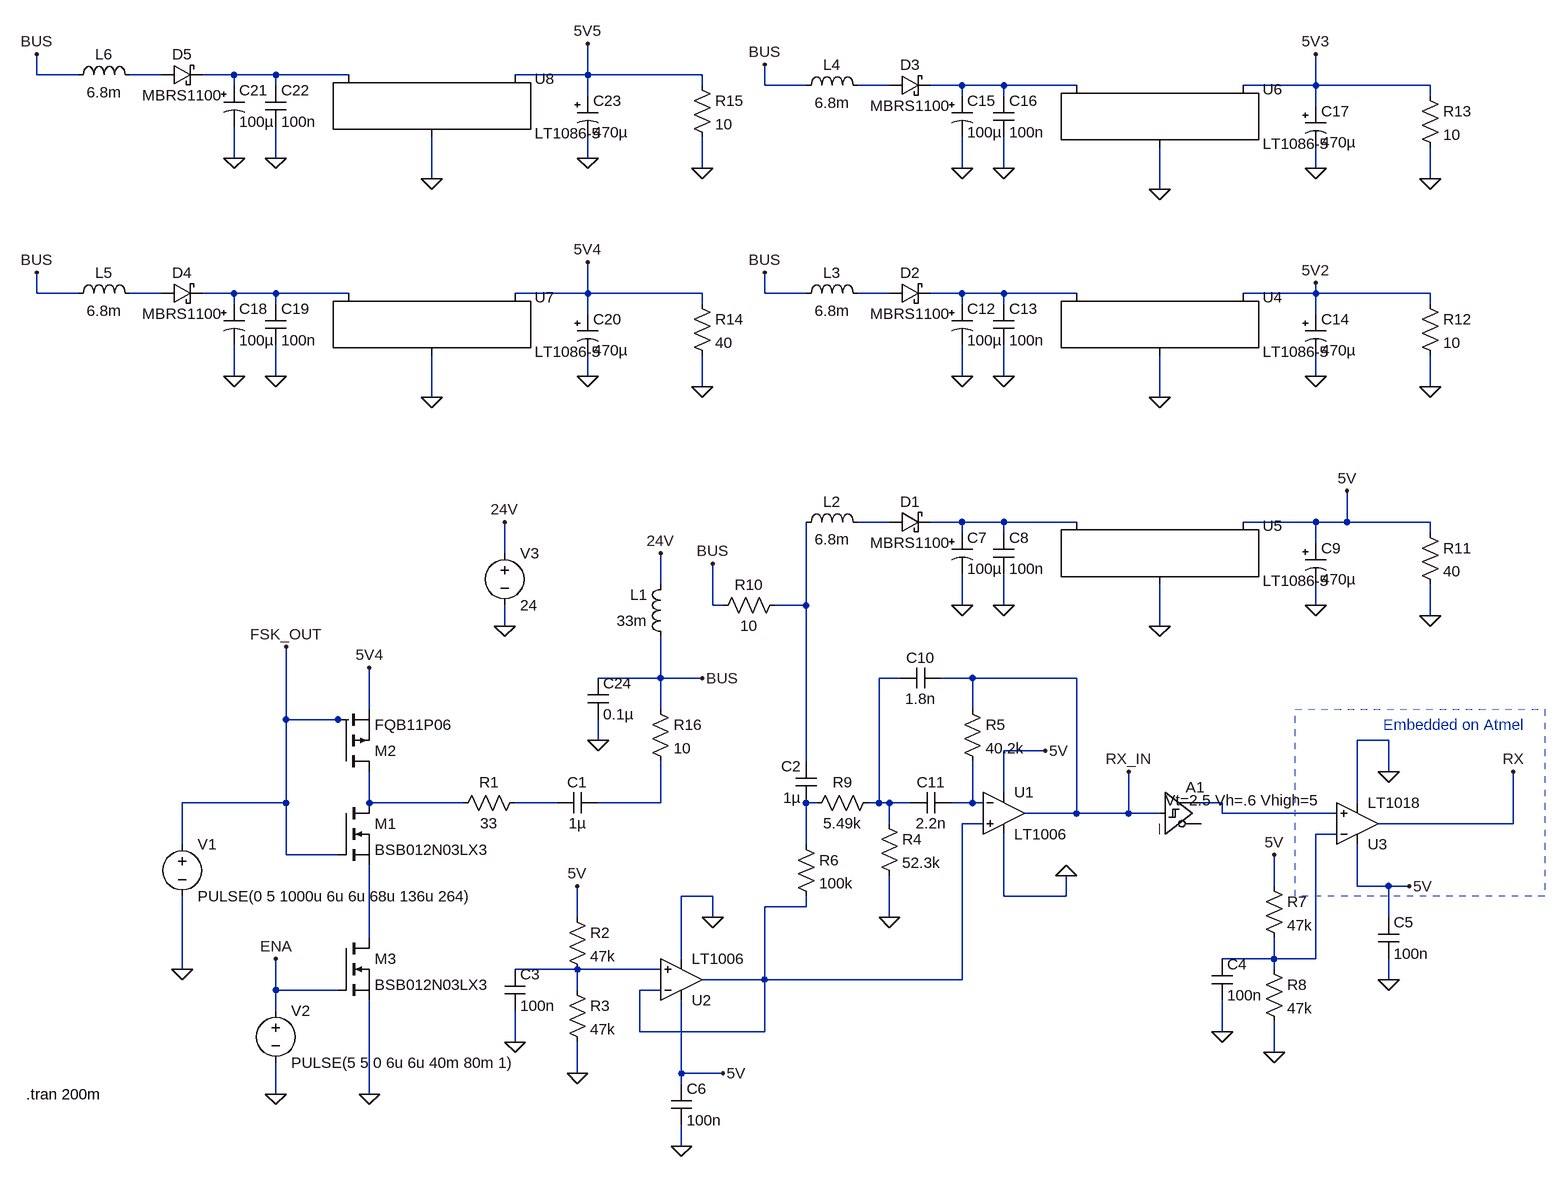
[diagram p0: schematic PWMOnDC_PBand.asc]
PWMOnDC_PBand.asc, the LTspice schematic file:
Version 4
SHEET 1 1552 788
WIRE -816 -928 -816 -960
WIRE -752 -928 -816 -928
WIRE -624 -928 -672 -928
WIRE -512 -928 -560 -928
WIRE -448 -928 -512 -928
WIRE -336 -928 -448 -928
WIRE 32 -928 32 -976
WIRE 32 -928 -80 -928
WIRE 208 -928 32 -928
WIRE -512 -912 -512 -928
WIRE -448 -912 -448 -928
WIRE 208 -912 208 -928
WIRE 304 -912 304 -944
WIRE 368 -912 304 -912
WIRE 496 -912 448 -912
WIRE 608 -912 560 -912
WIRE 672 -912 608 -912
WIRE 784 -912 672 -912
WIRE 1152 -912 1152 -960
WIRE 1152 -912 1040 -912
WIRE 1328 -912 1152 -912
WIRE 32 -896 32 -928
WIRE 608 -896 608 -912
WIRE 672 -896 672 -912
WIRE 1328 -896 1328 -912
WIRE 1152 -880 1152 -912
WIRE -512 -800 -512 -848
WIRE -448 -800 -448 -848
WIRE 32 -800 32 -832
WIRE 208 -784 208 -832
WIRE 608 -784 608 -832
WIRE 672 -784 672 -832
WIRE 1152 -784 1152 -816
WIRE -208 -768 -208 -832
WIRE 1328 -768 1328 -816
WIRE 912 -752 912 -816
WIRE -816 -592 -816 -624
WIRE -752 -592 -816 -592
WIRE -624 -592 -672 -592
WIRE -512 -592 -560 -592
WIRE -448 -592 -512 -592
WIRE -336 -592 -448 -592
WIRE 32 -592 32 -640
WIRE 32 -592 -80 -592
WIRE 208 -592 32 -592
WIRE 304 -592 304 -624
WIRE 368 -592 304 -592
WIRE 496 -592 448 -592
WIRE 608 -592 560 -592
WIRE 672 -592 608 -592
WIRE 784 -592 672 -592
WIRE 1152 -592 1152 -608
WIRE 1152 -592 1040 -592
WIRE 1328 -592 1152 -592
WIRE -512 -576 -512 -592
WIRE -448 -576 -448 -592
WIRE 208 -576 208 -592
WIRE 608 -576 608 -592
WIRE 672 -576 672 -592
WIRE 1328 -576 1328 -592
WIRE 32 -560 32 -592
WIRE 1152 -560 1152 -592
WIRE -512 -464 -512 -512
WIRE -448 -464 -448 -512
WIRE 32 -464 32 -496
WIRE 608 -464 608 -512
WIRE 672 -464 672 -512
WIRE 1152 -464 1152 -496
WIRE 208 -448 208 -496
WIRE 1328 -448 1328 -496
WIRE -208 -432 -208 -496
WIRE 912 -432 912 -496
WIRE 496 -240 448 -240
WIRE 608 -240 560 -240
WIRE 672 -240 608 -240
WIRE 784 -240 672 -240
WIRE 1152 -240 1040 -240
WIRE 1200 -240 1200 -288
WIRE 1200 -240 1152 -240
WIRE 1328 -240 1200 -240
WIRE 608 -224 608 -240
WIRE 672 -224 672 -240
WIRE 1328 -224 1328 -240
WIRE 1152 -208 1152 -240
WIRE -96 -192 -96 -240
WIRE 144 -144 144 -192
WIRE 224 -112 224 -176
WIRE 240 -112 224 -112
WIRE 368 -112 368 -240
WIRE 368 -112 320 -112
WIRE 608 -112 608 -160
WIRE 672 -112 672 -160
WIRE 1152 -112 1152 -144
WIRE 1328 -96 1328 -144
WIRE -96 -80 -96 -112
WIRE 912 -80 912 -144
WIRE 144 0 144 -64
WIRE 144 0 48 0
WIRE 208 0 144 0
WIRE 512 0 480 0
WIRE 624 0 576 0
WIRE 784 0 624 0
WIRE -304 48 -304 -16
WIRE 144 48 144 0
WIRE 624 48 624 0
WIRE -432 64 -432 -48
WIRE -352 64 -432 64
WIRE -336 64 -352 64
WIRE 48 96 48 64
WIRE 1264 96 1216 96
WIRE 736 112 672 112
WIRE 368 128 368 -112
WIRE 1264 144 1264 96
WIRE 672 176 672 112
WIRE -432 192 -432 64
WIRE -432 192 -592 192
WIRE -304 192 -304 144
WIRE -160 192 -304 192
WIRE -16 192 -80 192
WIRE 144 192 144 128
WIRE 144 192 48 192
WIRE 384 192 368 192
WIRE 480 192 480 0
WIRE 480 192 464 192
WIRE 496 192 480 192
WIRE 528 192 496 192
WIRE 624 192 624 128
WIRE 624 192 592 192
WIRE 640 192 624 192
WIRE 1008 192 976 192
WIRE 1216 192 1216 96
WIRE 784 208 784 0
WIRE 784 208 704 208
WIRE 864 208 864 144
WIRE 864 208 784 208
WIRE 912 208 864 208
WIRE 1008 208 1008 192
WIRE 1184 208 1008 208
WIRE 496 224 496 192
WIRE 640 224 608 224
WIRE 1456 224 1456 144
WIRE 1456 224 1248 224
WIRE 1184 240 1152 240
WIRE -592 256 -592 192
WIRE 368 256 368 192
WIRE -432 272 -432 192
WIRE -352 272 -432 272
WIRE 1088 320 1088 272
WIRE 1216 320 1216 256
WIRE 1264 320 1216 320
WIRE 1296 320 1264 320
WIRE 224 336 176 336
WIRE 672 336 672 240
WIRE 768 336 768 304
WIRE 768 336 672 336
WIRE 368 352 368 336
WIRE 368 352 304 352
WIRE 16 368 16 320
WIRE 224 368 224 336
WIRE 496 368 496 304
WIRE 1264 368 1264 320
WIRE -304 400 -304 288
WIRE 176 432 176 336
WIRE 1088 432 1088 400
WIRE 1088 432 1008 432
WIRE 1152 432 1152 240
WIRE 1152 432 1088 432
WIRE -592 448 -592 336
WIRE 16 448 -80 448
WIRE 144 448 16 448
WIRE 1088 448 1088 432
WIRE 304 464 304 352
WIRE 304 464 208 464
WIRE 608 464 608 224
WIRE 608 464 304 464
WIRE 1264 464 1264 432
WIRE -448 480 -448 432
WIRE -352 480 -448 480
WIRE 16 480 16 448
WIRE 144 480 112 480
WIRE -448 512 -448 480
WIRE 112 544 112 480
WIRE 304 544 304 464
WIRE 304 544 112 544
WIRE 1008 544 1008 496
WIRE -80 560 -80 512
WIRE 1088 576 1088 528
WIRE 16 608 16 560
WIRE 176 608 176 496
WIRE 240 608 176 608
WIRE 176 624 176 608
WIRE -448 640 -448 592
WIRE -304 640 -304 496
WIRE 176 720 176 688
FLAG -592 448 0
FLAG 16 320 5V
FLAG -304 -16 5V4
FLAG -304 640 0
FLAG 16 608 0
FLAG 224 368 0
FLAG 240 608 5V
FLAG 1456 144 RX
FLAG 1200 -288 5V
FLAG -96 -80 0
FLAG -96 -240 24V
FLAG 144 -192 24V
FLAG 768 304 0
FLAG 736 112 5V
FLAG 1296 320 5V
FLAG 1264 144 0
FLAG 1088 576 0
FLAG 1088 272 5V
FLAG 1008 544 0
FLAG -80 560 0
FLAG 176 720 0
FLAG 1264 464 0
FLAG 208 0 BUS
FLAG 224 -176 BUS
FLAG 608 -112 0
FLAG 672 -112 0
FLAG 1152 -112 0
FLAG 912 -80 0
FLAG 1328 -96 0
FLAG 304 -624 BUS
FLAG 608 -464 0
FLAG 672 -464 0
FLAG 1152 -464 0
FLAG 912 -432 0
FLAG 1328 -448 0
FLAG 304 -944 BUS
FLAG 608 -784 0
FLAG 672 -784 0
FLAG 1152 -784 0
FLAG 912 -752 0
FLAG 1328 -768 0
FLAG 1152 -608 5V2
FLAG 1152 -960 5V3
FLAG -816 -624 BUS
FLAG -512 -464 0
FLAG -448 -464 0
FLAG 32 -464 0
FLAG -208 -432 0
FLAG 208 -448 0
FLAG 32 -640 5V4
FLAG -816 -960 BUS
FLAG -512 -800 0
FLAG -448 -800 0
FLAG 32 -800 0
FLAG -208 -768 0
FLAG 208 -784 0
FLAG 32 -976 5V5
FLAG 48 96 0
FLAG -432 -48 FSK_OUT
FLAG -448 640 0
FLAG -448 432 ENA
FLAG 864 144 RX_IN
FLAG 496 368 0
SYMBOL voltage -592 240 R0
WINDOW 123 0 0 Left 2
WINDOW 39 24 124 Left 2
SYMATTR InstName V1
SYMATTR Value PULSE(0 5 1000u 6u 6u 68u 136u 264)
SYMBOL res -64 176 R90
WINDOW 0 0 56 VBottom 2
WINDOW 3 32 56 VTop 2
SYMATTR InstName R1
SYMATTR Value 33
SYMATTR SpiceLine tol=5
SYMBOL cap 384 192 R180
WINDOW 0 24 56 Left 2
WINDOW 3 24 8 Left 2
SYMATTR InstName C2
SYMATTR Value 1µ
SYMATTR SpiceLine V=50 Irms=0 Rser=0.008 Lser=0
SYMBOL res 0 352 R0
SYMATTR InstName R2
SYMATTR Value 47k
SYMATTR SpiceLine tol=5
SYMBOL res 0 464 R0
SYMATTR InstName R3
SYMATTR Value 47k
SYMATTR SpiceLine tol=5
SYMBOL res 352 240 R0
SYMATTR InstName R6
SYMATTR Value 100k
SYMATTR SpiceLine tol=5
SYMBOL voltage -96 -208 R0
WINDOW 123 0 0 Left 2
WINDOW 39 24 124 Left 2
SYMATTR InstName V3
SYMATTR Value 24
SYMBOL ind 160 -48 R180
WINDOW 0 36 80 Left 2
WINDOW 3 36 40 Left 2
SYMATTR InstName L1
SYMATTR Value 33m
SYMATTR SpiceLine Ipk=1.5 Rser=0.5 Rpar=0 Cpar=0
SYMBOL nmos -352 192 R0
SYMATTR InstName M1
SYMATTR Value BSB012N03LX3
SYMBOL cap 48 176 R90
WINDOW 0 0 32 VBottom 2
WINDOW 3 32 32 VTop 2
SYMATTR InstName C1
SYMATTR Value 1µ
SYMATTR SpiceLine V=50 Irms=0 Rser=0.008 Lser=0 mfg="TDK" pn="C3225X7RlHlO5M" type="X7R"
SYMBOL Comparators\\LT1018 1216 224 M180
SYMATTR InstName U3
SYMBOL res 1072 304 R0
SYMATTR InstName R7
SYMATTR Value 47k
SYMATTR SpiceLine tol=5
SYMBOL res 1072 432 R0
SYMATTR InstName R8
SYMATTR Value 47k
SYMATTR SpiceLine tol=5
SYMBOL cap -96 448 R0
SYMATTR InstName C3
SYMATTR Value 100n
SYMBOL cap 992 432 R0
SYMATTR InstName C4
SYMATTR Value 100n
SYMBOL cap 1248 368 R0
SYMATTR InstName C5
SYMATTR Value 100n
SYMBOL cap 160 624 R0
SYMATTR InstName C6
SYMATTR Value 100n
SYMBOL ind 352 -224 R270
WINDOW 0 32 56 VTop 2
WINDOW 3 5 56 VBottom 2
SYMATTR InstName L2
SYMATTR Value 6.8m
SYMATTR SpiceLine Ipk=0.15 Rser=1.5 Rpar=0 Cpar=0
SYMBOL polcap 592 -224 R0
WINDOW 3 24 56 Left 2
SYMATTR Value 100µ
SYMATTR InstName C7
SYMATTR Description Capacitor
SYMATTR Type cap
SYMATTR SpiceLine V=63 Irms=600m Rser=0.19 Lser=0 mfg="Panasonic" pn="ECA1JFQ101L" type="Al electrolytic"
SYMBOL cap 656 -224 R0
SYMATTR InstName C8
SYMATTR Value 100n
SYMBOL polcap 1136 -208 R0
WINDOW 3 24 56 Left 2
SYMATTR Value 470µ
SYMATTR InstName C9
SYMATTR Description Capacitor
SYMATTR Type cap
SYMATTR SpiceLine V=6.3 Irms=445m Rser=0.17 Lser=0
SYMBOL PowerProducts\\LT1086-5 912 -240 R0
SYMATTR InstName U5
SYMBOL Opamps\\LT1006 672 144 R0
SYMATTR InstName U1
SYMBOL Opamps\\LT1006 176 528 M180
SYMATTR InstName U2
SYMBOL cap 576 -16 R90
WINDOW 0 0 32 VBottom 2
WINDOW 3 32 32 VTop 2
SYMATTR InstName C10
SYMATTR Value 1.8n
SYMBOL res 480 176 R90
WINDOW 0 0 56 VBottom 2
WINDOW 3 32 56 VTop 2
SYMATTR InstName R9
SYMATTR Value 5.49k
SYMATTR SpiceLine tol=1
SYMBOL pmos -352 144 M180
SYMATTR InstName M2
SYMATTR Value FQB11P06
SYMBOL res 1312 -240 R0
SYMATTR InstName R11
SYMATTR Value 40
SYMBOL schottky 496 -224 R270
WINDOW 0 32 32 VTop 2
WINDOW 3 0 32 VBottom 2
SYMATTR InstName D1
SYMATTR Value MBRS1100
SYMATTR Description Diode
SYMATTR Type diode
SYMBOL ind 352 -576 R270
WINDOW 0 32 56 VTop 2
WINDOW 3 5 56 VBottom 2
SYMATTR InstName L3
SYMATTR Value 6.8m
SYMATTR SpiceLine Ipk=0.15 Rser=1.5 Rpar=0 Cpar=0
SYMBOL polcap 592 -576 R0
WINDOW 3 24 56 Left 2
SYMATTR Value 100µ
SYMATTR InstName C12
SYMATTR Description Capacitor
SYMATTR Type cap
SYMATTR SpiceLine V=63 Irms=600m Rser=0.19 Lser=0 mfg="Panasonic" pn="ECA1JFQ101L" type="Al electrolytic"
SYMBOL cap 656 -576 R0
SYMATTR InstName C13
SYMATTR Value 100n
SYMBOL polcap 1136 -560 R0
WINDOW 3 24 56 Left 2
SYMATTR Value 470µ
SYMATTR InstName C14
SYMATTR Description Capacitor
SYMATTR Type cap
SYMATTR SpiceLine V=6.3 Irms=445m Rser=0.17 Lser=0
SYMBOL PowerProducts\\LT1086-5 912 -592 R0
SYMATTR InstName U4
SYMBOL res 1312 -592 R0
SYMATTR InstName R12
SYMATTR Value 10
SYMBOL schottky 496 -576 R270
WINDOW 0 32 32 VTop 2
WINDOW 3 0 32 VBottom 2
SYMATTR InstName D2
SYMATTR Value MBRS1100
SYMATTR Description Diode
SYMATTR Type diode
SYMBOL ind 352 -896 R270
WINDOW 0 32 56 VTop 2
WINDOW 3 5 56 VBottom 2
SYMATTR InstName L4
SYMATTR Value 6.8m
SYMATTR SpiceLine Ipk=0.15 Rser=1.5 Rpar=0 Cpar=0
SYMBOL polcap 592 -896 R0
WINDOW 3 24 56 Left 2
SYMATTR Value 100µ
SYMATTR InstName C15
SYMATTR Description Capacitor
SYMATTR Type cap
SYMATTR SpiceLine V=63 Irms=600m Rser=0.19 Lser=0 mfg="Panasonic" pn="ECA1JFQ101L" type="Al electrolytic"
SYMBOL cap 656 -896 R0
SYMATTR InstName C16
SYMATTR Value 100n
SYMBOL polcap 1136 -880 R0
WINDOW 3 24 56 Left 2
SYMATTR Value 470µ
SYMATTR InstName C17
SYMATTR Description Capacitor
SYMATTR Type cap
SYMATTR SpiceLine V=6.3 Irms=445m Rser=0.17 Lser=0
SYMBOL PowerProducts\\LT1086-5 912 -912 R0
SYMATTR InstName U6
SYMBOL res 1312 -912 R0
SYMATTR InstName R13
SYMATTR Value 10
SYMBOL schottky 496 -896 R270
WINDOW 0 32 32 VTop 2
WINDOW 3 0 32 VBottom 2
SYMATTR InstName D3
SYMATTR Value MBRS1100
SYMATTR Description Diode
SYMATTR Type diode
SYMBOL ind -768 -576 R270
WINDOW 0 32 56 VTop 2
WINDOW 3 5 56 VBottom 2
SYMATTR InstName L5
SYMATTR Value 6.8m
SYMATTR SpiceLine Ipk=0.15 Rser=1.5 Rpar=0 Cpar=0
SYMBOL polcap -528 -576 R0
WINDOW 3 24 56 Left 2
SYMATTR Value 100µ
SYMATTR InstName C18
SYMATTR Description Capacitor
SYMATTR Type cap
SYMATTR SpiceLine V=63 Irms=600m Rser=0.19 Lser=0 mfg="Panasonic" pn="ECA1JFQ101L" type="Al electrolytic"
SYMBOL cap -464 -576 R0
SYMATTR InstName C19
SYMATTR Value 100n
SYMBOL polcap 16 -560 R0
WINDOW 3 24 56 Left 2
SYMATTR Value 470µ
SYMATTR InstName C20
SYMATTR Description Capacitor
SYMATTR Type cap
SYMATTR SpiceLine V=6.3 Irms=445m Rser=0.17 Lser=0
SYMBOL PowerProducts\\LT1086-5 -208 -592 R0
SYMATTR InstName U7
SYMBOL res 192 -592 R0
SYMATTR InstName R14
SYMATTR Value 40
SYMBOL schottky -624 -576 R270
WINDOW 0 32 32 VTop 2
WINDOW 3 0 32 VBottom 2
SYMATTR InstName D4
SYMATTR Value MBRS1100
SYMATTR Description Diode
SYMATTR Type diode
SYMBOL ind -768 -912 R270
WINDOW 0 32 56 VTop 2
WINDOW 3 5 56 VBottom 2
SYMATTR InstName L6
SYMATTR Value 6.8m
SYMATTR SpiceLine Ipk=0.15 Rser=1.5 Rpar=0 Cpar=0
SYMBOL polcap -528 -912 R0
WINDOW 3 24 56 Left 2
SYMATTR Value 100µ
SYMATTR InstName C21
SYMATTR Description Capacitor
SYMATTR Type cap
SYMATTR SpiceLine V=63 Irms=600m Rser=0.19 Lser=0 mfg="Panasonic" pn="ECA1JFQ101L" type="Al electrolytic"
SYMBOL cap -464 -912 R0
SYMATTR InstName C22
SYMATTR Value 100n
SYMBOL polcap 16 -896 R0
WINDOW 3 24 56 Left 2
SYMATTR Value 470µ
SYMATTR InstName C23
SYMATTR Description Capacitor
SYMATTR Type cap
SYMATTR SpiceLine V=6.3 Irms=445m Rser=0.17 Lser=0
SYMBOL PowerProducts\\LT1086-5 -208 -928 R0
SYMATTR InstName U8
SYMBOL res 192 -928 R0
SYMATTR InstName R15
SYMATTR Value 10
SYMBOL schottky -624 -912 R270
WINDOW 0 32 32 VTop 2
WINDOW 3 0 32 VBottom 2
SYMATTR InstName D5
SYMATTR Value MBRS1100
SYMATTR Description Diode
SYMATTR Type diode
SYMBOL cap 32 0 R0
SYMATTR InstName C24
SYMATTR Value 0.1µ
SYMBOL nmos -352 400 R0
SYMATTR InstName M3
SYMATTR Value BSB012N03LX3
SYMBOL voltage -448 496 R0
WINDOW 123 0 0 Left 2
WINDOW 39 0 0 Left 2
SYMATTR InstName V2
SYMATTR Value PULSE(5 5 0 6u 6u 40m 80m 1)
SYMBOL res 480 208 R0
SYMATTR InstName R4
SYMATTR Value 52.3k
SYMATTR SpiceLine tol=1
SYMBOL cap 592 176 R90
WINDOW 0 0 32 VBottom 2
WINDOW 3 32 32 VTop 2
SYMATTR InstName C11
SYMATTR Value 2.2n
SYMBOL res 608 32 R0
SYMATTR InstName R5
SYMATTR Value 40.2k
SYMATTR SpiceLine tol=1
SYMBOL res 336 -128 R90
WINDOW 0 0 56 VBottom 2
WINDOW 3 32 56 VTop 2
SYMATTR InstName R10
SYMATTR Value 10
SYMBOL res 128 32 R0
SYMATTR InstName R16
SYMATTR Value 10
SYMBOL Digital\\schmitt 912 144 R0
WINDOW 3 8 44 Left 2
SYMATTR InstName A1
SYMATTR Value Vt=2.5 Vh=.6 Vhigh=5
TEXT -832 640 Left 2 !.tran 200m
TEXT 1256 72 Left 2 ;Embedded on Atmel
RECTANGLE Normal 1504 336 1120 48 2

The netlist it stands for:
* PWMOnDC_PBand.asc
V1 FSK_OUT 0 PULSE(0 5 1000u 6u 6u 68u 136u 264)
R1 N014 N013 33 tol=5
C2 N016 N011 1µ V=50 Irms=0 Rser=0.008 Lser=0
R2 5V N022 47k tol=5
R3 N022 0 47k tol=5
R6 N016 N019 100k tol=5
V3 24V 0 24
L1 BUS 24V 33m Ipk=1.5 Rser=0.5 Rpar=0 Cpar=0
M1 N013 FSK_OUT N021 N021 BSB012N03LX3
C1 N015 N014 1µ V=50 Irms=0 Rser=0.008 Lser=0 mfg="TDK" pn="C3225X7RlHlO5M" type="X7R"
XU3 N018 N020 5V 0 RX LT1018  ; pins In+ In- V+ V- OUT
R7 5V N020 47k tol=5
R8 N020 0 47k tol=5
C3 N022 0 100n
C4 N020 0 100n
C5 5V 0 100n
C6 5V 0 100n
L2 N011 N009 6.8m Ipk=0.15 Rser=1.5 Rpar=0 Cpar=0
C7 N010 0 100µ V=63 Irms=600m Rser=0.19 Lser=0 mfg="Panasonic" pn="ECA1JFQ101L" type="Al electrolytic"
C8 N010 0 100n
C9 5V 0 470µ V=6.3 Irms=445m Rser=0.17 Lser=0
XU5 0 5V N010 LT1086-5
XU1 N019 N017 5V 0 RX_IN LT1006  ; pins In+ In- V+ V- OUT
XU2 N022 N019 5V 0 N019 LT1006  ; pins In+ In- V+ V- OUT
C10 RX_IN N012 1.8n
R9 N012 N016 5.49k tol=1
M2 N013 FSK_OUT 5V4 5V4 FQB11P06
R11 5V 0 40
D1 N009 N010 MBRS1100
L3 BUS N007 6.8m Ipk=0.15 Rser=1.5 Rpar=0 Cpar=0
C12 N008 0 100µ V=63 Irms=600m Rser=0.19 Lser=0 mfg="Panasonic" pn="ECA1JFQ101L" type="Al electrolytic"
C13 N008 0 100n
C14 5V2 0 470µ V=6.3 Irms=445m Rser=0.17 Lser=0
XU4 0 5V2 N008 LT1086-5
R12 5V2 0 10
D2 N007 N008 MBRS1100
L4 BUS N003 6.8m Ipk=0.15 Rser=1.5 Rpar=0 Cpar=0
C15 N004 0 100µ V=63 Irms=600m Rser=0.19 Lser=0 mfg="Panasonic" pn="ECA1JFQ101L" type="Al electrolytic"
C16 N004 0 100n
C17 5V3 0 470µ V=6.3 Irms=445m Rser=0.17 Lser=0
XU6 0 5V3 N004 LT1086-5
R13 5V3 0 10
D3 N003 N004 MBRS1100
L5 BUS N005 6.8m Ipk=0.15 Rser=1.5 Rpar=0 Cpar=0
C18 N006 0 100µ V=63 Irms=600m Rser=0.19 Lser=0 mfg="Panasonic" pn="ECA1JFQ101L" type="Al electrolytic"
C19 N006 0 100n
C20 5V4 0 470µ V=6.3 Irms=445m Rser=0.17 Lser=0
XU7 0 5V4 N006 LT1086-5
R14 5V4 0 40
D4 N005 N006 MBRS1100
L6 BUS N001 6.8m Ipk=0.15 Rser=1.5 Rpar=0 Cpar=0
C21 N002 0 100µ V=63 Irms=600m Rser=0.19 Lser=0 mfg="Panasonic" pn="ECA1JFQ101L" type="Al electrolytic"
C22 N002 0 100n
C23 5V5 0 470µ V=6.3 Irms=445m Rser=0.17 Lser=0
XU8 0 5V5 N002 LT1086-5
R15 5V5 0 10
D5 N001 N002 MBRS1100
C24 BUS 0 0.1µ
M3 N021 ENA 0 0 BSB012N03LX3
V2 ENA 0 PULSE(5 5 0 6u 6u 40m 80m 1)
R4 N012 0 52.3k tol=1
C11 N017 N012 2.2n
R5 RX_IN N017 40.2k tol=1
R10 N011 BUS 10
R16 BUS N015 10
A1 RX_IN 0 0 0 0 0 N018 0 SCHMITT Vt=2.5 Vh=.6 Vhigh=5
.model D D
.lib standard.dio
.model NMOS NMOS
.model PMOS PMOS
.lib standard.mos
.tran 200m
* Embedded on Atmel
.lib LTC1.lib
.lib LTC.lib
.backanno
.end